# EAGLE design aparture_v2 (EAGLE 6.3)
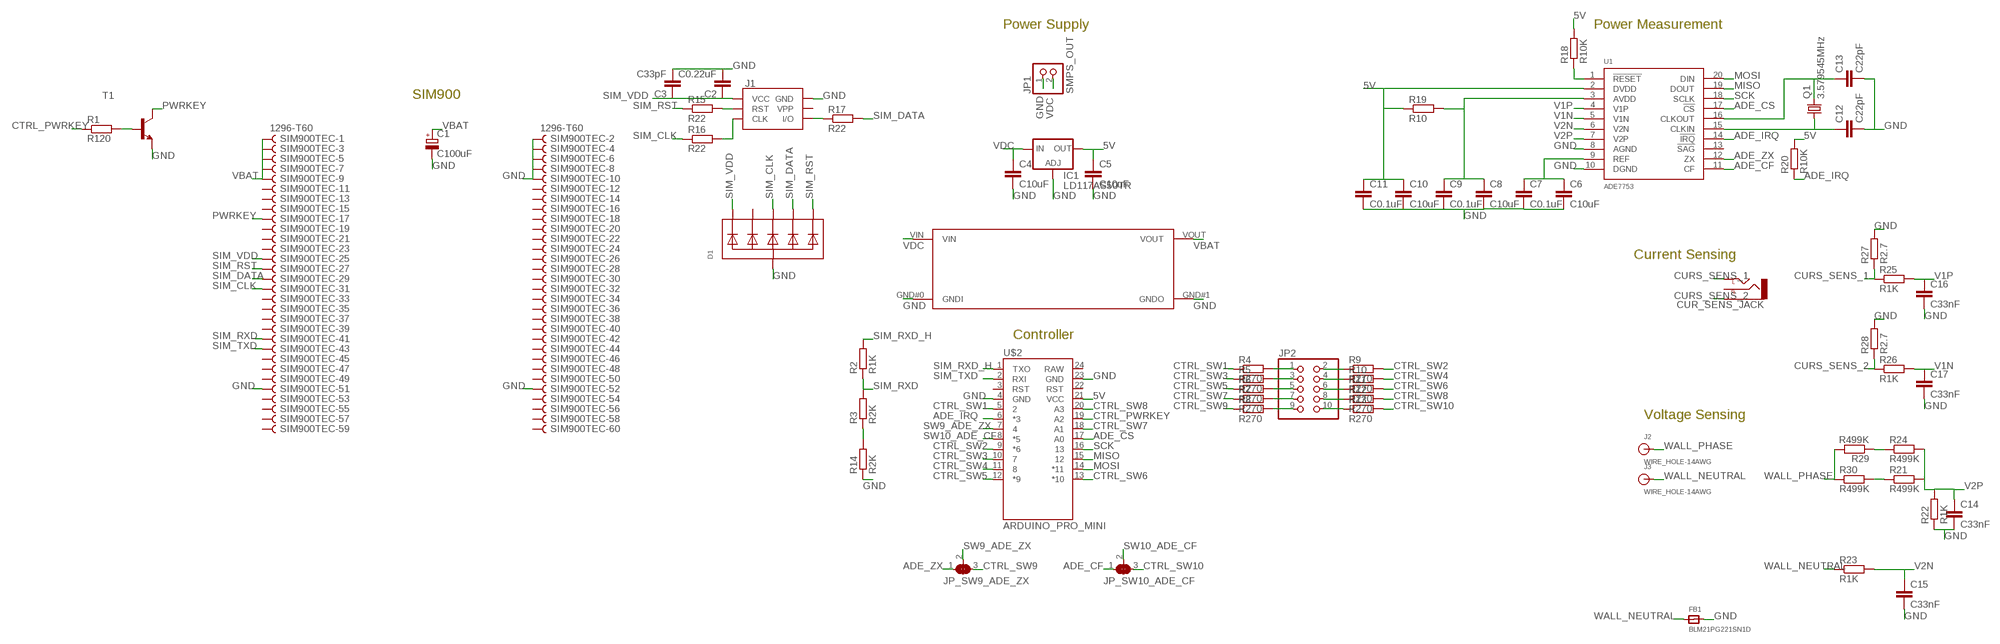
[diagram p0: schematic, sheet 1]

## Parts
C1  C100uF  CPOL-EU153CLV-0605  [153CLV-0605]
C2  C0.22uF  C-EUC0805  [C0805]
C3  C33pF  C-EUC0805  [C0805]
C4  C10uF  C-EUC0805  [C0805]
C5  C10uF  C-EUC0805  [C0805]
C6  C10uF  C-EUC0805  [C0805]
C7  C0.1uF  C-EUC0805  [C0805]
C8  C10uF  C-EUC0805  [C0805]
C9  C0.1uF  C-EUC0805  [C0805]
C10  C10uF  C-EUC0805  [C0805]
C11  C0.1uF  C-EUC0805  [C0805]
C12  C22pF  C-EUC0805  [C0805]
C13  C22pF  C-EUC0805  [C0805]
C14  C33nF  C-EUC0805  [C0805]
C15  C33nF  C-EUC0805  [C0805]
C16  C33nF  C-EUC0805  [C0805]
C17  C33nF  C-EUC0805  [C0805]
CUR_SENS_JACK  AUDIO-JACKSMD2  [AUDIO-JACK-3.5MM-SMD]
D1  TVSARRAY_5LANE  [SOT363]
FB1  BLM21PG221SN1D  FERRITE0805  [0805]
IC1  LD117AS50TR  [SOT223]
J1  SIMHOLDERSIM  [SIMHOLDER]
J2  WIRE_HOLE-14AWG  [WIRE_HOLE-14AWG]
J3  WIRE_HOLE-14AWG  [WIRE_HOLE-14AWG]
JP1  SMPS_OUT  PINHD-1X2  [1X02]
JP2  PINHD-2X5  [2X05]
JP_SW9_ADE_ZX  SOLDERJUMPER_2WAY0603  [SOLDERJUMPER_2WAY_OPEN_0603]
JP_SW10_ADE_CF  SOLDERJUMPER_2WAY0603  [SOLDERJUMPER_2WAY_OPEN_0603]
Q1  3.579545MHz  CRYSTALHC49S  [HC49/S]
R1  R120  R-EU_R0805  [R0805]
R2  R1K  R-EU_M0805  [M0805]
R3  R2K  R-EU_M0805  [M0805]
R4  R270  R-EU_R0603  [R0603]
R5  R270  R-EU_R0603  [R0603]
R6  R270  R-EU_R0603  [R0603]
R7  R270  R-EU_R0603  [R0603]
R8  R270  R-EU_R0603  [R0603]
R9  R270  R-EU_R0603  [R0603]
R10  R270  R-EU_R0603  [R0603]
R11  R270  R-EU_R0603  [R0603]
R12  R270  R-EU_R0603  [R0603]
R13  R270  R-EU_R0603  [R0603]
R14  R2K  R-EU_M0805  [M0805]
R15  R22  R-EU_R0603  [R0603]
R16  R22  R-EU_R0603  [R0603]
R17  R22  R-EU_R0603  [R0603]
R18  R10K  R-EU_R0805  [R0805]
R19  R10  R-EU_R0805  [R0805]
R20  R10K  R-EU_R0805  [R0805]
R21  R499K  R-EU_R0805  [R0805]
R22  R1K  R-EU_R0805  [R0805]
R23  R1K  R-EU_R0805  [R0805]
R24  R499K  R-EU_0309/V  [0309V]
R25  R1K  R-EU_R0805  [R0805]
R26  R1K  R-EU_R0805  [R0805]
R27  R2.7  R-EU_0309/V  [0309V]
R28  R2.7  R-EU_0309/V  [0309V]
R29  R499K  R-EU_0309/V  [0309V]
R30  R499K  R-EU_R0805  [R0805]
SIM900TEC  1296-T60  [1296-60]
T1  MMBT2222ALT1-NPN-SOT23-BEC  [SOT23-BEC]
U1  ADE7753  [SSOP-20]
U$1  DCDCMODULE  [DCDCMODULE]
U$2  ARDUINO_PRO_MINI  [ARDUINO_PRO_MINI]

## Nets
5V: C5.1 C10.1 C11.1 IC1.4(OUT) R18.2 R19.1 R20.2 U1.2(DVDD) U$2.21(VCC)
ADE_CF: JP_SW10_ADE_CF.1 U1.11(CF)
ADE_CS: U1.17(!CS) U$2.17(A0)
ADE_IRQ: R20.1 U1.14(!IRQ) U$2.6(*3)
ADE_ZX: JP_SW9_ADE_ZX.1 U1.12(ZX)
CTRL_PWRKEY: R1.1 U$2.19(A2)
CTRL_SW1: R4.1 U$2.5
CTRL_SW2: R9.2 U$2.9(*6)
CTRL_SW3: R5.1 U$2.10
CTRL_SW4: R10.2 U$2.11
CTRL_SW5: R6.1 U$2.12(*9)
CTRL_SW6: R11.2 U$2.13(*10)
CTRL_SW7: R7.1 U$2.18(A1)
CTRL_SW8: R12.2 U$2.20(A3)
CTRL_SW9: JP_SW9_ADE_ZX.3 R8.1
CTRL_SW10: JP_SW10_ADE_CF.3 R13.2
CURS_SENS_1: CUR_SENS_JACK.TIP(LEFT) R25.1 R27.1
CURS_SENS_2: CUR_SENS_JACK.SLEEVE R26.1 R28.1
GND: C1.- C2.2 C3.2 C4.2 C5.2 C6.2 C7.2 C8.2 C9.2 C10.2 C11.2 C12.2 C13.2 C14.2 C15.2 C16.2 C17.2 D1.2(A) FB1.2 IC1.1(ADJ) J1.C5(GND) JP1.1 R14.1 R22.1 R27.2 R28.2 SIM900TEC.2 SIM900TEC.4 SIM900TEC.6 SIM900TEC.8 SIM900TEC.10 SIM900TEC.51 SIM900TEC.52 T1.E U1.8(AGND) U1.10(DGND) U$1.GND#0(GNDI) U$1.GND#1(GNDO) U$2.4(GND) U$2.23(GND)
MISO: U1.19(DOUT) U$2.15
MOSI: U1.20(DIN) U$2.14(*11)
N$1: R1.2 T1.B
N$2: JP2.1 R4.2
N$3: JP2.3 R5.2
N$4: JP2.5 R6.2
N$5: JP2.7 R7.2
N$6: R24.1 R29.1
N$7: JP2.2 R9.1
N$8: JP2.4 R10.1
N$9: JP2.6 R11.1
N$10: JP2.8 R12.1
N$11: JP2.9 R8.2
N$12: R3.1 R14.2
N$13: J1.C2(RST) R15.2
N$14: J1.C3(CLK) R16.2
N$15: J1.C7(I/O) R17.1
N$16: R18.1 U1.1(!RESET)
N$17: C6.1 C7.1 U1.9(REF)
N$18: C8.1 C9.1 R19.2 U1.3(AVDD)
N$19: C12.1 Q1.1 U1.15(CLKIN)
N$20: C13.1 Q1.2 U1.16(CLKOUT)
N$21: JP2.10 R13.1
N$22: R21.1 R30.2
PWRKEY: SIM900TEC.17 T1.C
SCK: U1.18(SCLK) U$2.16
SIM_CLK: D1.4(C3) R16.1 SIM900TEC.31
SIM_DATA: D1.5(C4) R17.2 SIM900TEC.29
SIM_RST: D1.6(C5) R15.1 SIM900TEC.27
SIM_RXD: R2.1 R3.2 SIM900TEC.41
SIM_RXD_H: R2.2 U$2.1(TXO)
SIM_TXD: SIM900TEC.43 U$2.2(RXI)
SIM_VDD: C2.1 C3.1 D1.1(C1) J1.C1(VCC) SIM900TEC.25
SW9_ADE_ZX: JP_SW9_ADE_ZX.2 U$2.7
SW10_ADE_CF: JP_SW10_ADE_CF.2 U$2.8(*5)
V1N: C17.1 R26.2 U1.5(V1N)
V1P: C16.1 R25.2 U1.4(V1P)
V2N: C15.1 R23.2 U1.6(V2N)
V2P: C14.1 R21.2 R22.2 R24.2 U1.7(V2P)
VBAT: C1.+ SIM900TEC.1 SIM900TEC.3 SIM900TEC.5 SIM900TEC.7 SIM900TEC.9 U$1.VOUT
VDC: C4.1 IC1.3(IN) JP1.2 U$1.VIN
WALL_NEUTRAL: FB1.1 J3.P$1 R23.1
WALL_PHASE: J2.P$1 R29.2 R30.1
Unconnected: CUR_SENS_JACK.RING(RIGHT) D1.3(C2) J1.C6(VPP) SIM900TEC.11 SIM900TEC.12 SIM900TEC.13 SIM900TEC.14 SIM900TEC.15 SIM900TEC.16 SIM900TEC.18 SIM900TEC.19 SIM900TEC.20 SIM900TEC.21 SIM900TEC.22 SIM900TEC.23 SIM900TEC.24 SIM900TEC.26 SIM900TEC.28 SIM900TEC.30 SIM900TEC.32 SIM900TEC.33 SIM900TEC.34 SIM900TEC.35 SIM900TEC.36 SIM900TEC.37 SIM900TEC.38 SIM900TEC.39 SIM900TEC.40 SIM900TEC.42 SIM900TEC.44 SIM900TEC.45 SIM900TEC.46 SIM900TEC.47 SIM900TEC.48 SIM900TEC.49 SIM900TEC.50 SIM900TEC.53 SIM900TEC.54 SIM900TEC.55 SIM900TEC.56 SIM900TEC.57 SIM900TEC.58 SIM900TEC.59 SIM900TEC.60 U1.13(!SAG) U$2.3(RST) U$2.22(RST) U$2.24(RAW)

## Notes on the sheet
- Power Supply | Power Measurement
- SIM900
- Current Sensing
- Controller
- Voltage Sensing

## Library data of the parts
C1 = resistor:CPOL-EU: POLARIZED CAPACITOR, European symbol
C2-C17 = resistor:C-EU: CAPACITOR, European symbol
CUR_SENS_JACK = SparkFun-Connectors:AUDIO-JACK: 3.5mm Audio Jack Simple 3.5mm common PCB mount audio jack. SKU: PRT-08032; PROD_ID: CONN-10353
D1 = microbuilder:TVSARRAY_5LANE: Voltage Transient Suppressor Array SOT363 SMF05C - 100W 5V: Digikey - SMF05CT1GOSCT-ND
FB1 = microbuilder:FERRITE: Ferrite Bead 0603 MMZ1608B121C - 120 Ohm @ 100MHz, 600mA, 0.15 Ohm DC Resistance - Digikey: 445-2164-1-ND BK1608HW121-T - 120 Ohm, 600mA Ferrite Chip - Digikey: 587-1876-2-ND 0805 HZ0805B272R-10 - 2.7K Ohm @ 100MHz, 200mA, 0.8 Ohm DC Resistance - Digikey: 240-2504-1-ND (see also Murata BLM21BD272SN1L) MMZ2012Y152B - 1.5K Ohm @ 100MHz, 500mA, 0.4 Ohm DC Resistance - Digikey: 445-1560-1-ND - Mainly for high frequency (80-400MHz) MMZ2012R102A - 1K Ohm @ 100MHz, 500mA, 0.3 Ohm DC Resistance - Digikey: 445-1555-2-ND - More general purpose (10-200MHz)
IC1 = v-reg:LD117A?*: Low drop fixed and adjustable positive voltage regulators 1 A Source: http://www.st.com/stonline/products/literature/ds/7194/ld1117axx.pdf
J1 = SparkFun-Connectors:SIMHOLDER: SIM Socket Socket for SIM cellular cards. Schematic element and footprint production proven. Spark Fun Electronics SKU : PRT-00548; PROD_ID: CONN-08536
J2 J3 = powercube:WIRE_HOLE-14AWG: Solder point for 14AWG wire
JP1 = pinhead:PINHD-1X2: PIN HEADER
JP2 = pinhead:PINHD-2X5: PIN HEADER
JP_SW9_ADE_ZX JP_SW10_ADE_CF = microbuilder:SOLDERJUMPER_2WAY: 2-Way Solder Jumper
Q1 = crystal:CRYSTAL: CRYSTAL; OC_FARNELL: 1667008; OC_NEWARK: unknown
R1-R30 = resistor:R-EU_: RESISTOR, European symbol
SIM900TEC = con-leotronics:1296-T60: 1.27mm SINGLE ROW FEMALE SOCKET Source: http://www.leotronics.co.uk/Conexcon/Data%20Sheets/sec.%20A/1296ing.pdf; OC_FARNELL: unknown; OC_NEWARK: unknown
T1 = transistor-neu-to92:*-NPN-: NPN Transistror
U1 = powercube:ADE7753: Single-Phase Multifunction Metering IC; DIGIKEY: ADE7753ARSZRLCT-ND; MOUSER: 584-ADE7753ARSZR; NEWARK: 59K0984
U$1 = bontor:DCDCMODULE
U$2 = tigorcustom:ARDUINO_PRO_MINI

## Board
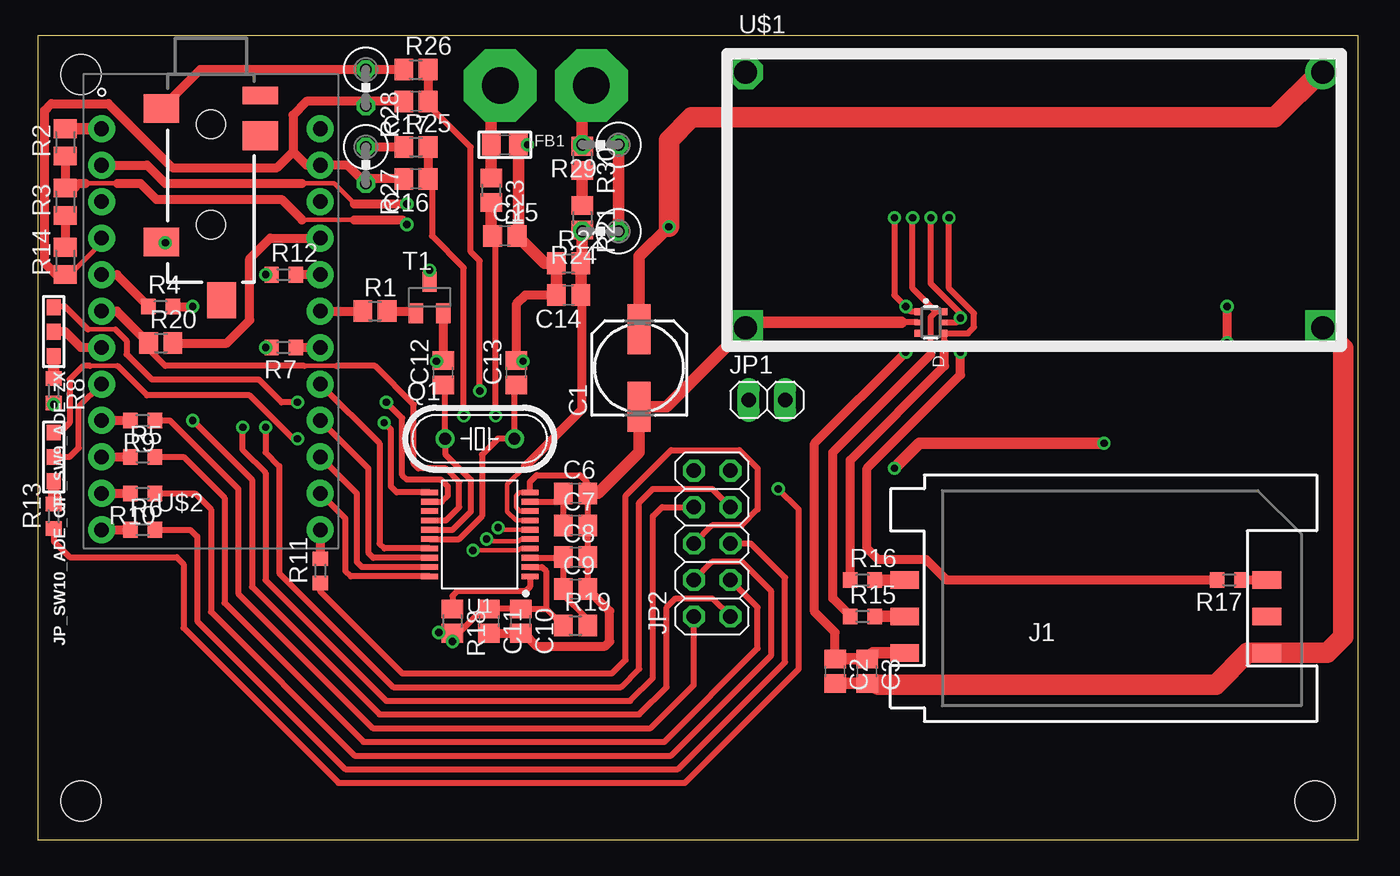
[diagram p1: board, top side]
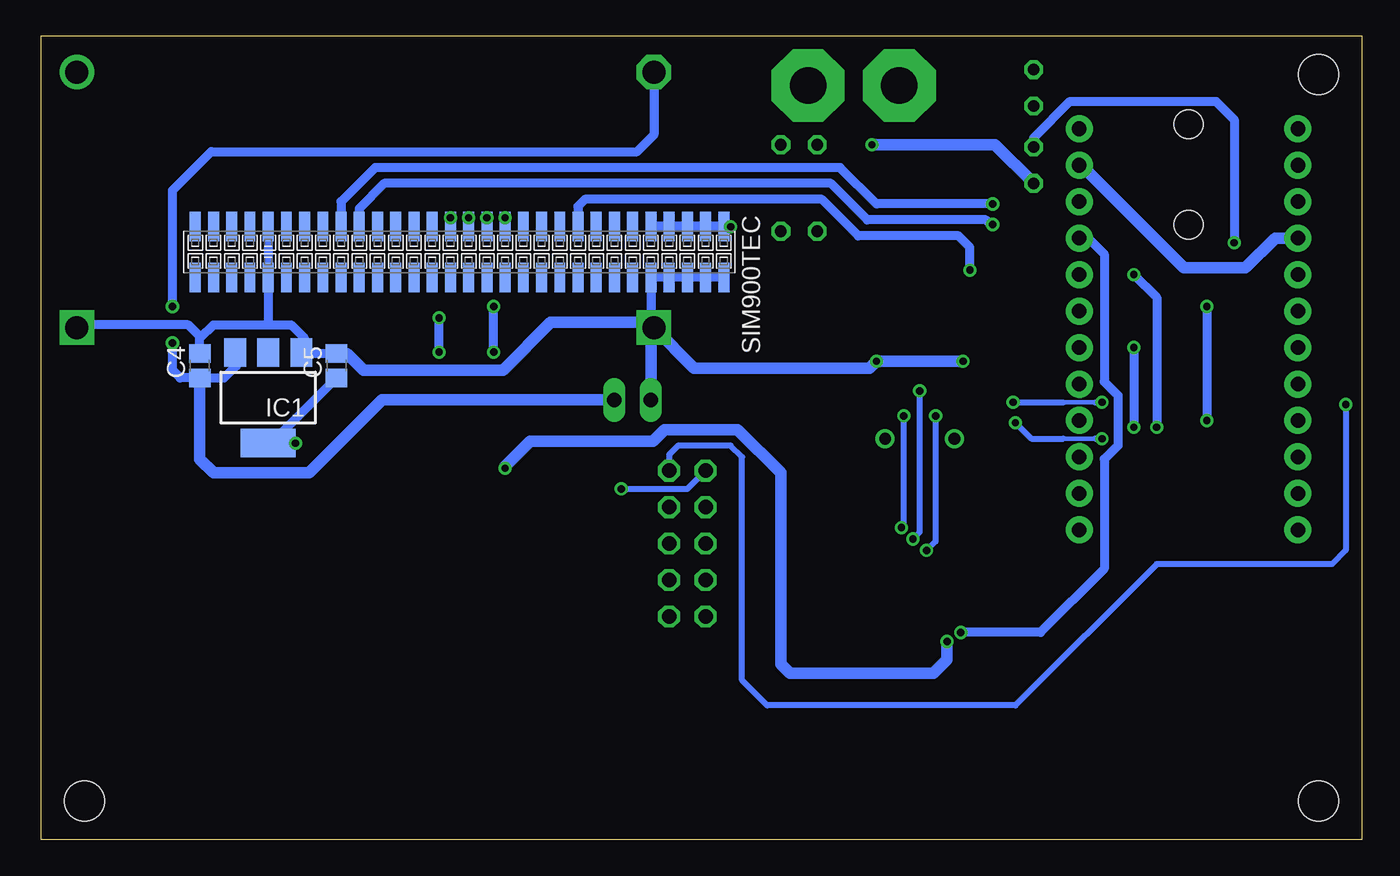
[diagram p2: board, bottom side, seen from below]

Size 92 x 56 mm. Coordinates in mm from the lower left corner, seen from the top.
Outline: 0,0 92,0 92,56 0,56 0,0
Copper layers (1*16): Top 0.035mm / dielectric 1.5mm / Bottom 0.035mm
Design rules "default": minimum track width 10mil, minimum drill 24mil, track to track 8mil, track to pad 8mil, pad to pad 8mil, via to via 8mil, smd to smd 8mil, copper to edge 40mil, drill to drill 8mil, minimum pad ring 10mil, minimum via ring 8mil, stop-mask expansion 4mil, vias tented up to drill 0mil, thermal gap 10mil
Holes 2.8 mm at 89,2.7 3,53.3 3,2.7

### Footprints (pad centres in the part's own frame; a part is rotated, then mirrored left to right if it is on the bottom)
153CLV-0605 = smd 3.5 x 1.6: + 2.7,0; - -2.7,0
C0805 = smd 1.3 x 1.5: 1 -0.85,0; 2 0.85,0
AUDIO-JACK-3.5MM-SMD = smd 2 x 2.5: RING 4.3,3.45; SLEEVE 2.4,-3.45; TIP 11.7,-3.45 | smd 1.2 x 2.5: RSH 1.5,3.45 | smd 2.5 x 2: TSH 15.75,0.75 | hole 2: 3.5,0; 10.5,0
SOT363 = smd 0.5 x 0.5: 1 -0.75,-0.9; 3 0.75,-0.9; 4 0.75,0.9; 6 -0.75,0.9 | smd 0.4 x 0.5: 2 0,-0.9; 5 0,0.9
0805 = smd 1.3 x 1.5: 1 -0.95,0; 2 0.95,0
SOT223 = smd 1.5 x 2: 1 -2.3,-3.15; 2 0,-3.15; 3 2.3,-3.15 | smd 3.8 x 2: 4 0,3.15
SIMHOLDER = smd 2 x 1.2: C1 -12.61,-3.81; C2 -12.61,-1.27; C3 -12.61,1.27; C5 12.61,-3.81; C6 12.61,-1.27; C7 12.61,1.27
WIRE_HOLE-14AWG = drill 2.54 pad 5.08 octagon: P$1 0,0
1X02 = drill 1.016 long: 1 -1.27,0; 2 1.27,0
2X05 = drill 1.016 octagon: 1 -5.08,-1.27; 2 -5.08,1.27; 3 -2.54,-1.27; 4 -2.54,1.27; 5 0,-1.27; 6 0,1.27; 7 2.54,-1.27; 8 2.54,1.27; 9 5.08,-1.27; 10 5.08,1.27
SOLDERJUMPER_2WAY_OPEN_0603 = smd 1.1 x 1: 1 -1.7,0; 2 0,0; 3 1.7,0
HC49/S = drill 0.813: 1 -2.413,0; 2 2.413,0
R0805 = smd 1.3 x 1.5: 1 -0.85,0; 2 0.85,0
M0805 = smd 1.3 x 1.6: 1 -0.95,0; 2 0.95,0
R0603 = smd 1 x 1.1: 1 -0.85,0; 2 0.85,0
0309V = drill 0.813 octagon: 1 -1.27,0; 2 1.27,0
1296-60 = smd 0.76 x 2.05: 1 -18.415,-1.78; 2 -18.415,1.78; 3 -17.145,-1.78; 4 -17.145,1.78; 5 -15.875,-1.78; 6 -15.875,1.78; 7 -14.605,-1.78; 8 -14.605,1.78; 9 -13.335,-1.78; 10 -13.335,1.78; 11 -12.065,-1.78; 12 -12.065,1.78; 13 -10.795,-1.78; 14 -10.795,1.78; 15 -9.525,-1.78; 16 -9.525,1.78; 17 -8.255,-1.78; 18 -8.255,1.78; 19 -6.985,-1.78; 20 -6.985,1.78; 21 -5.715,-1.78; 22 -5.715,1.78; 23 -4.445,-1.78; 24 -4.445,1.78; 25 -3.175,-1.78; 26 -3.175,1.78; 27 -1.905,-1.78; 28 -1.905,1.78; 29 -0.635,-1.78; 30 -0.635,1.78; 31 0.635,-1.78; 32 0.635,1.78; 33 1.905,-1.78; 34 1.905,1.78; 35 3.175,-1.78; 36 3.175,1.78; 37 4.445,-1.78; 38 4.445,1.78; 39 5.715,-1.78; 40 5.715,1.78; 41 6.985,-1.78; 42 6.985,1.78; 43 8.255,-1.78; 44 8.255,1.78; 45 9.525,-1.78; 46 9.525,1.78; 47 10.795,-1.78; 48 10.795,1.78; 49 12.065,-1.78; 50 12.065,1.78; 51 13.335,-1.78; 52 13.335,1.78; 53 14.605,-1.78; 54 14.605,1.78; 55 15.875,-1.78; 56 15.875,1.78; 57 17.145,-1.78; 58 17.145,1.78; 59 18.415,-1.78; 60 18.415,1.78
SOT23-BEC = smd 1 x 1.4: B -0.95,-1.1; C 0,1.1; E 0.95,-1.1
SSOP-20 = smd 1.2 x 0.4: 1 -3.5,2.925; 2 -3.5,2.275; 3 -3.5,1.625; 4 -3.5,0.975; 5 -3.5,0.325; 6 -3.5,-0.325; 7 -3.5,-0.975; 8 -3.5,-1.625; 9 -3.5,-2.275; 10 -3.5,-2.925; 11 3.5,-2.925; 12 3.5,-2.275; 13 3.5,-1.625; 14 3.5,-0.975; 15 3.5,-0.325; 16 3.5,0.325; 17 3.5,0.975; 18 3.5,1.625; 19 3.5,2.275; 20 3.5,2.925
DCDCMODULE = drill 1.6 square: GND#0 1.7,1.7; GND#1 41.9,1.7 | drill 1.6 octagon: VIN 1.7,19.5 | drill 1.6: VOUT 41.9,19.5
ARDUINO_PRO_MINI = drill 1.016 pad 1.88: 1 -7.62,12.7; 2 -7.62,10.16; 3 -7.62,7.62; 4 -7.62,5.08; 5 -7.62,2.54; 6 -7.62,0; 7 -7.62,-2.54; 8 -7.62,-5.08; 9 -7.62,-7.62; 10 -7.62,-10.16; 11 -7.62,-12.7; 12 -7.62,-15.24; 13 7.62,-15.24; 14 7.62,-12.7; 15 7.62,-10.16; 16 7.62,-7.62; 17 7.62,-5.08; 18 7.62,-2.54; 19 7.62,0; 20 7.62,2.54; 21 7.62,5.08; 22 7.62,7.62; 23 7.62,10.16; 24 7.62,12.7

### Placement (x,y rotation side)
C1  41.91,32.86 90 top
C2  55.56,11.75 270 top
C3  57.78,11.75 270 top
C4  80.96,33.02 90 bottom
C5  71.44,33.02 90 bottom
C6  37.47,24.13 0 top
C7  37.47,21.91 0 top
C8  37.47,19.68 0 top
C9  37.47,17.46 0 top
C10  33.66,15.24 270 top
C11  31.43,15.24 270 top
C12  28.26,32.54 90 top
C13  33.34,32.54 90 top
C14  36.99,37.94 180 top
C15  32.54,42.07 0 top
C16  26.35,46.04 180 top
C17  26.35,51.44 180 top
CUR_SENS_JACK  12.06,53.34 270 top
D1  62.23,36.04 270 top
FB1  32.54,48.42 0 top
IC1  76.2,30.8 180 bottom
J1  73.03,16.83 0 top
J2  38.58,52.55 270 top
J3  32.23,52.55 270 top
JP1  50.8,30.64 0 top
JP2  46.99,20.64 90 top
JP_SW9_ADE_ZX  1.11,35.4 270 top
JP_SW10_ADE_CF  1.11,26.67 270 top
Q1  30.8,27.94 0 top
R1  23.5,36.83 0 top
R2  1.91,48.58 90 top
R3  1.91,44.45 90 top
R4  8.57,37.15 0 top
R5  7.3,26.67 0 top
R6  7.3,21.59 0 top
R7  17.14,34.29 180 top
R8  1.11,31.27 270 top
R9  7.3,29.21 180 top
R10  7.3,24.13 180 top
R11  19.68,18.73 90 top
R12  17.14,39.37 0 top
R13  1.11,22.54 90 top
R14  1.91,40.32 90 top
R15  57.47,15.56 0 top
R16  57.47,18.1 0 top
R17  83.03,18.1 180 top
R18  28.89,15.24 270 top
R19  37.47,14.92 0 top
R20  8.57,34.61 0 top
R21  37.94,43.34 270 top
R22  36.99,40.16 0 top
R23  31.59,45.24 270 top
R24  39.21,42.39 180 top
R25  26.35,48.26 0 top
R26  26.35,53.66 0 top
R27  22.86,46.99 270 top
R28  22.86,52.39 270 top
R29  39.21,48.42 180 top
R30  37.94,47.47 270 top
SIM900TEC  62.87,40.96 180 bottom
T1  27.3,37.78 0 top
U1  30.8,21.27 180 top
U$1  47.62,33.97 0 top
U$2  12.06,36.83 0 top

### Tracks (layer width: path | path; a pad name or v marks a point on that pad's centre or on a via)
5V  (via drill 0.51)
  Top 0.406: R18.2 29.11,14.61 29.53,14.61 31.01,16.09 C11.1 C10.1 35.45,16.09 | 35.45,16.09 R19.1 | U1.2 35.14,19 35.4,18.73 35.4,16.14 35.45,16.09
  Top 0.61: R20.2 13.18,34.61 14.76,36.2 14.76,40.48 16.19,41.91 U$2.21 | R18.2 28,14.39 v27.94,14.45
  Top 0.813: R18.2 v28.89,13.81 | v74.3,27.62 61.44,27.62 v59.69,25.88
  Bottom 0.61: IC1.4 75.96,27.65 C5.1 | U$2.21 19.05,41.91 17.94,40.8 17.94,31.91 16.99,30.96 16.99,27.46 17.94,26.51 17.94,18.89 22.38,14.45 v27.94,14.45
  Bottom 0.813: v28.89,13.81 28.89,12.54 29.84,11.59 39.85,11.59 40.48,12.22 40.48,25.56 43.5,28.57 48.58,28.57 49.37,27.78 57.94,27.78 59.69,26.04 v59.69,25.88 | 75.96,27.65 74.32,27.65 v74.3,27.62
ADE_CF  (via drill 0.51)
  Top 0.305: 5.56,33.02 3.65,33.02
  Top 0.406: U1.11 25.02,24.2 24.61,24.61 24.61,28.57 v24.13,29.05 | v18.1,27.94 17.78,27.94 14.76,30.96 7.62,30.96 5.56,33.02 | 3.65,33.02 3.17,33.02 2.22,32.07 2.22,29.05 1.59,28.42 1.16,28.42 JP_SW10_ADE_CF.1
  Bottom 0.305: 20.8,27.94 18.57,27.94
  Bottom 0.406: v24.13,29.05 23.02,27.94 20.8,27.94 | 18.57,27.94 v18.1,27.94
ADE_CS
  Top 0.406: U$2.17 23.81,27.62 23.81,20.64 24.15,20.3 U1.17
ADE_IRQ
  Top 0.305: 20.8,33.02 18.57,33.02
  Top 0.406: U1.14 28.44,22.25 29.37,23.18 29.37,24.92 28.42,25.88 26.51,25.88 26.19,26.19 26.19,30.32 23.5,33.02 20.8,33.02 | 18.57,33.02 8.89,33.02 7.94,33.97 7.94,34.39 R20.1
  Top 0.61: U$2.6 5.5,36.83 R20.1
ADE_ZX  (via drill 0.51)
  Top 0.305: 5.4,35.56 3.49,35.56
  Top 0.406: U1.12 28.15,23.55 28.57,23.97 28.57,24.61 28.1,25.08 25.72,25.08 25.4,25.4 25.4,29.37 v24.29,30.48 | v18.1,30.48 16.99,30.48 15.4,32.07 7.94,32.07 6.19,33.81 6.19,34.77 5.4,35.56 | 3.49,35.56 1.91,37.15 1.16,37.15 JP_SW9_ADE_ZX.1
  Bottom 0.305: 20.8,30.48 18.57,30.48
  Bottom 0.406: v24.29,30.48 20.8,30.48 | 18.57,30.48 v18.1,30.48
CTRL_PWRKEY
  Top 0.61: U$2.19 R1.1
CTRL_SW1
  Top 0.61: U$2.5 5.5,39.37 R4.1
CTRL_SW2
  Top 0.61: U$2.9 R9.2
CTRL_SW3
  Top 0.61: U$2.10 R5.1
CTRL_SW4
  Top 0.61: U$2.11 R10.2
CTRL_SW5
  Top 0.61: U$2.12 R6.1
CTRL_SW6
  Top 0.61: U$2.13 R11.2
CTRL_SW7
  Top 0.61: U$2.18 R7.1
CTRL_SW8
  Top 0.61: U$2.20 R12.2
CTRL_SW9
  Top 0.813: JP_SW9_ADE_ZX.3 R8.1
CTRL_SW10
  Top 0.813: JP_SW10_ADE_CF.3 R13.2
CURS_SENS_1  (via drill 0.51)
  Top 0.61: R25.1 R27.1
  Top 0.813: CUR_SENS_JACK.TIP 8.84,41.64 v8.89,41.59
  Bottom 0.61: R27.1 22.86,48.9 20.32,51.44 10.16,51.44 8.89,50.16 v8.89,41.59
CURS_SENS_2
  Top 0.61: R26.1 R28.1 11.33,53.66 CUR_SENS_JACK.SLEEVE
GND  (via drill 0.51)
  Top 0.305: U1.8 33.62,22.9 33.34,23.18 33.34,23.97 33.56,24.2 U1.10 | 2.23,39.37 4.29,41.43 4.29,41.75 U$2.4
  Top 0.406: C9.2 C8.2 C7.2 C6.2 38.26,24.19 38.26,24.92 37.78,25.4 34.77,25.4 34.3,24.93 U1.10 | D1.2 60.17,36.04 | R14.1 2.23,39.37
  Top 0.61: C17.2 23.18,51.44 R28.2 22.54,51.44 18.73,51.44 17.78,50.48 17.78,47.94 | C16.2 23.18,46.04 R27.2 21.59,46.99 U$2.23 18.73,46.99 17.78,47.94 | 17.78,47.94 16.67,46.83 9.37,46.83 4.92,51.28 0.95,51.28 0.48,50.8 0.48,40.16 1.27,39.37 R14.1 | C11.2 C10.2 33.87,14.39 34.77,13.49 39.53,13.49 39.85,13.81 39.85,15.93 C9.2 | C14.2 33.97,37.94 33.34,37.31 C13.2 | T1.E C12.2 | v34.13,48.42 FB1.2
  Top 0.813: C14.2 R22.1 35.3,40.16 C15.2 33.49,42.17 FB1.2 | C2.2 C3.2 57.89,10.79 58.58,10.79 | C6.2 39.05,24.13 41.91,26.99 C1.- 43.81,30.16 U$1.GND#0 49.69,36.04 60.17,36.04 | C12.2 27.84,33.4 v27.78,33.34 | C13.2 33.76,33.39 v33.81,33.34
  Top 1.422: U$1.GND#1 90.96,34.23 90.96,14.13 89.85,13.02 J1.C5 84.3,13.02 82.07,10.79 58.58,10.79
  Bottom 0.61: C4.2 80.96,34.92 | 80.96,34.92 80.01,35.88 76.2,35.88 | 76.2,35.88 74.61,35.88 73.66,34.92 73.66,34.19 IC1.1 73.82,33.87 C5.2 | SIM900TEC.2 SIM900TEC.4 SIM900TEC.6 SIM900TEC.8 SIM900TEC.10 49.53,35.88 | SIM900TEC.51 SIM900TEC.52 76.2,35.88 | 89.53,35.73 U$1.GND#1 89.32,35.88 81.76,35.88 80.96,35.08 80.96,34.92
  Bottom 0.813: v27.78,33.34 v33.81,33.34 34.29,32.86 46.51,32.86 U$1.GND#0 | v34.13,48.42 25.56,48.42 R27.2 | U$1.GND#0 49.53,35.88 JP1.1 | C5.2 70.7,33.87 69.53,32.7 59.85,32.7 56.52,36.04 49.69,36.04 U$1.GND#0 | U$2.4 6.03,41.91 8.1,39.85 12.38,39.85 19.53,46.99 U$2.23
MISO
  Top 0.406: U$2.15 22.23,24.13 22.23,19.37 22.59,19 U1.19
MOSI
  Top 0.406: U$2.14 21.43,22.38 21.43,18.73 21.82,18.35 U1.20
N$1
  Top 0.61: R1.2 26.21,36.83 T1.B
N$2  (via drill 0.51)
  Top 0.406: v10.79,29.21 14.92,25.08 14.92,17.62 23.81,8.73 41.91,8.73 43.81,10.64 43.81,16.19 44.45,16.83 46.99,16.83 JP2.1
  Top 0.61: R4.2 v10.79,37.15
  Bottom 0.61: v10.79,37.15 v10.79,29.21
N$3
  Top 0.406: R5.2 10.16,26.67 13.02,23.81 13.02,16.51 22.7,6.83 43.66,6.83 50.16,13.34 50.16,16.19 JP2.3
N$4
  Top 0.406: R6.2 10.64,21.59 11.11,21.11 11.11,15.24 21.43,4.92 44.61,4.92 52.07,12.38 52.07,18.26 49.69,20.64 JP2.5
N$5  (via drill 0.51)
  Top 0.406: v15.88,28.73 15.88,26.99 16.83,26.04 16.83,18.57 24.77,10.64 40.64,10.64 41.91,11.91 41.91,23.5 42.86,24.45 46.99,24.45 JP2.7
  Top 0.813: R7.2 v15.88,34.29
  Bottom 0.61: v15.88,34.29 v15.88,28.73
N$6
  Top 0.813: R29.1 R24.1
N$7
  Top 0.406: R9.1 9.21,29.21 13.97,24.45 13.97,17.14 23.34,7.78 42.7,7.78 45.72,10.79 JP2.2
N$8
  Top 0.406: R10.1 10.95,24.13 12.06,23.02 12.06,15.88 22.07,5.87 44.13,5.87 51.12,12.86 51.12,17.3 49.05,19.37 46.99,19.37 JP2.4
N$9
  Top 0.406: R11.1 19.68,17.3 25.4,11.59 40.01,11.59 40.96,12.54 40.96,23.97 44.13,27.15 48.9,27.15 50.16,25.88 50.16,23.02 49.05,21.91 46.99,21.91 JP2.6
  Top 0.61: R11.1 19.74,17.88
N$10  (via drill 0.51)
  Top 0.406: JP2.8 43.5,23.18 42.86,22.54 42.86,11.27 41.27,9.68 24.29,9.68 15.88,18.1 15.88,25.56 14.29,27.15 v14.29,28.73
  Top 0.61: R12.1 v15.88,39.37
  Bottom 0.61: v15.88,39.37 14.29,37.78 v14.29,28.73
N$11  (via drill 0.51)
  Top 0.813: R8.2 v1.11,30.32
  Bottom 0.406: v1.11,30.32 1.11,20.16 2.06,19.21 14.29,19.21 24.13,9.37 41.43,9.37 43.18,11.11 43.18,26.67 43.97,27.46 47.62,27.46 48.26,26.83 JP2.9
N$12
  Top 0.61: R3.1 R14.2
N$13
  Top 0.813: J1.C2 R15.2
N$14
  Top 0.813: J1.C3 R16.2
N$15
  Top 0.61: J1.C7 R17.1
N$16
  Top 0.406: U1.1 34.3,17.63 33.97,17.3 29.21,17.3 28.89,16.99 R18.1
N$17
  Top 0.406: C6.1 36.62,23.5 | 36.62,23.5 C7.1 | U1.9 36.56,23.55 36.62,23.5
N$18
  Top 0.305: C9.1 36.62,17.04 | 38.1,15.56 38.1,15.14 R19.2
  Top 0.406: U1.3 36.26,19.65 C8.1 C9.1 | 36.62,17.04 38.1,15.56
N$19
  Top 0.406: U1.15 28.9,21.6 30.16,22.86 30.16,25.08 28.38,26.86 Q1.1 28.38,31.57 C12.1 28.38,31.66
N$20
  Top 0.406: U1.16 29.36,20.95 30.96,22.54 30.96,26.83 32.07,27.94 Q1.2 33.21,31.57 C13.1 33.21,31.66
N$21  (via drill 0.51)
  Top 0.406: R13.1 1.11,20.8 2.22,19.68 9.68,19.68 10.16,19.21 10.16,14.76 20.95,3.97 45.09,3.97 53.02,11.91 53.02,23.02 v51.59,24.45
  Bottom 0.406: v51.59,24.45 46.99,24.45 JP2.10
N$22
  Top 0.813: R30.2 R21.1
PWRKEY  (via drill 0.51)
  Top 0.61: T1.C v27.3,39.69
  Bottom 0.61: v27.3,39.69 27.3,41.27 28.1,42.07 35.08,42.07 37.62,44.61 54.13,44.61 54.61,44.13 SIM900TEC.17
SCK
  Top 0.406: U$2.16 23.02,25.88 23.02,20 23.37,19.65 U1.18
SIM_CLK  (via drill 0.51)
  Top 0.406: v63.5,43.34 63.5,38.42 65.25,36.67 65.25,35.72 64.81,35.29 D1.4 63.18,35.23 63.18,34.61
  Top 0.61: R16.1 56.62,26.45 63.18,33.02 63.18,34.61
  Bottom 0.406: v63.5,43.34 SIM900TEC.31
SIM_DATA  (via drill 0.51)
  Top 0.406: v62.23,43.34 62.23,38.73 64.29,36.67 v64.29,36.35 63.98,36.04 D1.5
  Top 0.61: R17.2 63.34,18.1 61.91,19.53 58.58,19.53 57.78,20.32 57.78,25.88 64.29,32.38 v64.29,33.97
  Bottom 0.406: v62.23,43.34 SIM900TEC.29
  Bottom 0.61: v64.29,33.97 v64.29,36.35
SIM_RST  (via drill 0.51)
  Top 0.406: D1.6 62.59,36.79 | 62.59,36.79 60.96,38.42 v60.96,43.34 | 62.23,33.81 62.23,36.42 62.59,36.79
  Top 0.61: R15.1 56.62,15.61 55.4,16.83 55.4,26.99 62.23,33.81
  Bottom 0.406: v60.96,43.34 SIM900TEC.27
SIM_RXD  (via drill 0.51)
  Top 0.305: 3.33,45.72 5.56,45.72 | 18.41,43.18 22.07,43.18
  Top 0.61: R2.1 R3.2 2.54,45.4 2.86,45.72 3.33,45.72 | 5.56,45.72 7.14,45.72 8.26,44.61 16.99,44.61 18.41,43.18 | 22.07,43.18 25.4,43.18 v25.72,42.86
  Bottom 0.61: SIM900TEC.41 69.85,43.97 68.1,45.72 36.99,45.72 34.45,43.18 26.19,43.18 25.88,42.86 v25.72,42.86
SIM_RXD_H
  Top 0.61: 1.59,49.53 R2.2
  Top 0.813: 1.59,49.53 U$2.1
SIM_TXD  (via drill 0.51)
  Top 0.305: 18.41,45.72 20.64,45.72 22.07,44.29
  Top 0.61: U$2.2 7.62,46.99 8.89,45.72 18.41,45.72 | 22.07,44.29 v25.72,44.29
  Bottom 0.61: SIM900TEC.43 71.12,44.45 68.74,46.83 36.35,46.83 33.81,44.29 v25.72,44.29
SIM_VDD  (via drill 0.51)
  Top 0.406: D1.1 60.84,36.79 v60.48,37.15 59.69,37.94 v59.69,43.34
  Top 0.61: C2.1 55.56,14.45 54.13,15.88 54.13,27.62 v60.48,33.97
  Top 0.813: J1.C1 58.2,13.02 C3.1 C2.1
  Bottom 0.406: v59.69,43.34 SIM900TEC.25
  Bottom 0.61: v60.48,33.97 v60.48,37.15
SW9_ADE_ZX
  Top 0.61: U$2.7 3.02,34.29 1.91,35.4 JP_SW9_ADE_ZX.2
SW10_ADE_CF
  Top 0.406: JP_SW10_ADE_CF.2 2.22,26.67 2.86,27.3 2.86,30.16 U$2.8
V1N  (via drill 0.51)
  Top 0.305: U1.5 33.65,20.95 33.5,20.8 31.43,20.8 v31.27,20.95
  Top 0.406: C17.1 27.2,51.22 30.16,48.26 30.16,40.96 30.8,40.32 v30.8,31.27
  Top 0.61: R26.2 C17.1
  Bottom 0.406: v31.27,20.95 30.8,21.43 v30.8,31.27
V1P  (via drill 0.51)
  Top 0.305: U1.4 33.63,20.3 33.5,20.16 v30.32,20.16
  Top 0.406: C16.1 27.46,46.04 27.46,42.07 29.69,39.85 v29.69,29.53
  Top 0.61: R25.2 C16.1
  Bottom 0.406: v30.32,20.16 29.69,20.8 v29.69,29.53
V2N  (via drill 0.51)
  Top 0.305: U1.6 32.22,21.6 v32.07,21.75
  Top 0.406: v31.91,29.53 31.91,41.85 C15.1
  Top 0.813: R23.2 31.59,42.17 C15.1
  Bottom 0.406: v32.07,21.75 31.91,21.91 v31.91,29.53
V2P
  Top 0.305: U1.7 33.31,22.25 32.7,22.86 32.7,24.77 33.97,26.04
  Top 0.61: 33.97,26.04 37.94,30 37.94,37.84 C14.1
  Top 0.813: C14.1 R22.2 37.94,40.27 R24.2 R21.2
VBAT  (via drill 0.51)
  Top 0.813: v43.97,42.7 41.91,40.64 C1.+
  Top 1.422: U$1.VOUT 89.35,53.47 86.2,50.32 45.56,50.32 43.97,48.74 v43.97,42.7
  Bottom 0.61: SIM900TEC.1 SIM900TEC.3 SIM900TEC.5 SIM900TEC.7 SIM900TEC.9
  Bottom 0.813: SIM900TEC.1 44.01,42.74 v43.97,42.7
VDC  (via drill 0.51)
  Top 0.61: v82.87,37.15 v82.87,34.61
  Bottom 0.61: IC1.3 78.42,33.87 78.42,33.02 79.27,32.17 C4.1 82.33,32.17 82.87,32.7 v82.87,34.61 | v82.87,37.15 82.87,45.24 80.17,47.94 50.48,47.94 49.33,49.1 U$1.VIN
  Bottom 0.813: JP1.2 68.26,30.64 73.34,25.56 80.01,25.56 80.96,26.51 C4.1
WALL_NEUTRAL
  Top 0.813: R23.1 FB1.1 31.59,51.91 J3.P$1
WALL_PHASE
  Top 0.813: R30.1 R29.2 37.94,51.91 J2.P$1